# EAGLE schematic GSR (EAGLE 8.4.0)
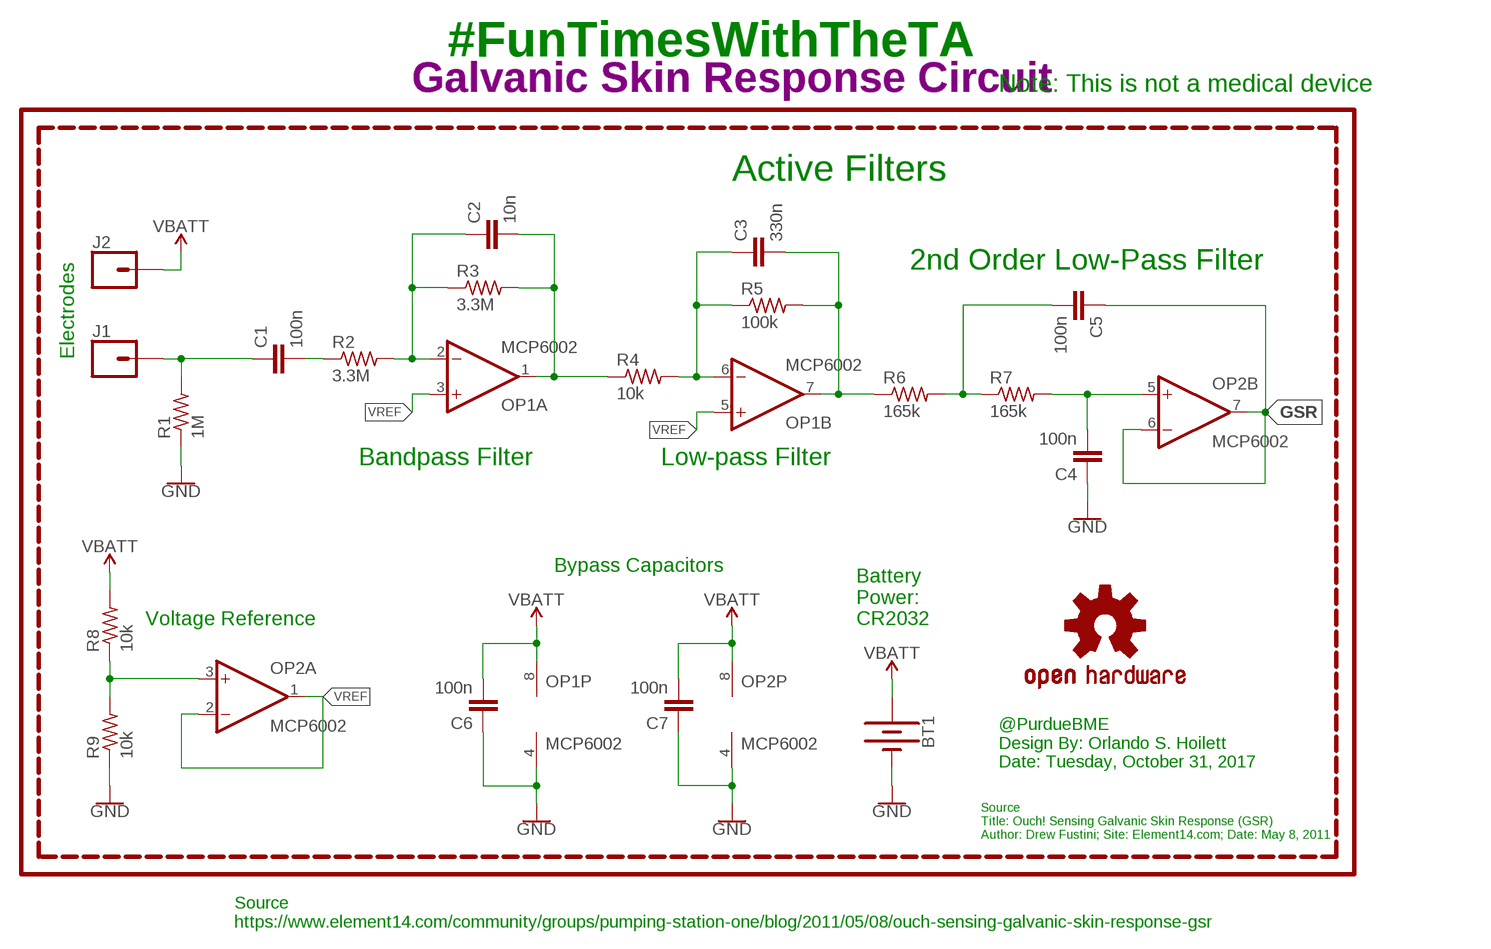
[diagram p0: schematic, sheet 1]

## Parts
BT1  BATTERY-20MM_SMD_4LEGS_OVERPASTE  [BATTCON_20MM_4LEGS_OVERPASTE]
C1  100n  CAPACITOR0402  [C0402]
C2  10n  CAPACITOR0402  [C0402]
C3  330n  CAPACITOR0402  [C0402]
C4  100n  CAPACITOR0402  [C0402]
C5  100n  CAPACITOR0402  [C0402]
C6  100n  CAPACITOR0402  [C0402]
C7  100n  CAPACITOR0402  [C0402]
J1  CONN_01  [1X01]
J2  CONN_01  [1X01]
LOGO1  OSHW-LOGOM  [OSHW-LOGO-M]
OP1  MCP6002  OP-DUALRM  [MSOP08]
OP2  MCP6002  OP-DUALRM  [MSOP08]
R1  1M  RESISTOR0402  [R0402]
R2  3.3M  RESISTOR0402  [R0402]
R3  3.3M  RESISTOR0402  [R0402]
R4  10k  RESISTOR0402  [R0402]
R5  100k  RESISTOR0402  [R0402]
R6  165k  RESISTOR0402  [R0402]
R7  165k  RESISTOR0402  [R0402]
R8  10k  RESISTOR0402  [R0402]
R9  10k  RESISTOR0402  [R0402]

## Nets
GND: BT1.2(-) C4.1 C6.1 C7.1 OP1.4(P:V-) OP2.4(P:V-) R1.1 R9.1
GSR: C5.1 OP2.6(B:-IN) OP2.7(B:OUT)
N$1: C1.2 R2.1
N$2: C2.1 OP1.2(A:-IN) R2.2 R3.1
N$3: C5.2 R6.2 R7.1
N$4: C2.2 OP1.1(A:OUT) R3.2 R4.1
N$5: C4.2 OP2.5(B:+IN) R7.2
N$7: C1.1 J1.1 R1.2
N$8: C3.1 OP1.6(B:-IN) R4.2 R5.1
N$10: C3.2 OP1.7(B:OUT) R5.2 R6.1
N$13: OP2.3(A:+IN) R8.1 R9.2
V_BATT: BT1.1(+) C6.2 C7.2 J2.1 OP1.8(P:V+) OP2.8(P:V+) R8.2 ; supply symbol labelled VBATT
VREF: OP1.3(A:+IN) OP1.5(B:+IN) OP2.1(A:OUT) OP2.2(A:-IN)

## Notes on the sheet
- #FunTimesWithTheTA
- Galvanic Skin Response Circuit | Note: This is not a medical device
- Active Filters
- 2nd Order Low-Pass Filter
- Electrodes
- Bandpass Filter | Low-pass Filter
- Bypass Capacitors
- Voltage Reference
- Battery
  Power:
  CR2032
- @PurdueBME
  Design By: Orlando S. Hoilett
  Date: Tuesday, October 31, 2017
- Source
  Title: Ouch! Sensing Galvanic Skin Response (GSR)
  Author: Drew Fustini; Site: Element14.com; Date: May 8, 2011
- Source
  https://www.element14.com/community/groups/pumping-station-one/blog/2011/05/08/ouch-sensing-galvanic-skin-response-gsr

## Library data of the parts
BT1 = CalvEngIO-Connectors:BATTERY: Battery - Single Cell A variety of battery chemistries, sizes, and footprints. Device List: 20MM_PTH - Coin Cell Battery Holder - 20mm (PTH) <https://www.sparkfun.com/products/783> 6.8MM_PTH - Coin Cell Battery Holder - 6.8MM(SMD) <https://www.digikey.com/product-detail/en/seiko-instruments/MS621FE-FL11E/728-1057-ND/1889208?WT.srch=1&gclid=CNOQ5a6LzdQCFZS2wAodXCkE0g> 12MM_SMD - Coin Cell Battery Holder - 12mm (SMD) <https://www.sparkfun.com/products/10592> 12MM_PTH - Coin Cell Battery Holder - 12mm (PTH) <https://www.sparkfun.com/products/7948> 20MM_SMD - 20mm Coin Cell Battery Holder (SMD) (2 legs) Used on the Big Time Watch Kit <https://www.sparkfun.com/products/11734> 20MM_SMD_4LEGS - Coin Cell Battery Holder - 20mm (SMD) <https://www.sparkfun.com/products/11892> 20MM_SMD_4LEGS_OVERPASTE - Coin Cell Battery Holder - 20mm (SMD) <https://www.sparkfun.com/products/11892> (Over-paste on the legs) 24.5MM_PTH - Coin Cell Battery Holder - 24.5mm (PTH) <https://www.sparkfun.com/products/8863> 9V - 9V Battery Holder - PC Mount Used on the SparkFun SparkPunk Sound Kit <https://www.sparkfun.com/products/11177> and SparkFun SparkPunk Sequencer Kit <https://www.sparkfun.com/products/12707> 18650 - Battery Holder - 18650 (PTH) <https://www.sparkfun.com/products/13113> AA - Battery Holder - 1xAA (PTH) <https://www.sparkfun.com/products/7949> AAA - Battery Holder - 1xAAA (PTH) <https://www.sparkfun.com/products/12718> AA_KIT - Battery Holder - 1xAA (PTH) <https://www.sparkfun.com/products/7949> Special kit package - pads only have exposed copper on one side of the board. AAA_KIT - Battery Holder - 1xAAA (PTH) <https://www.sparkfun.com/products/12718> Special kit package - pads only have exposed copper on one side of the board.; PROD_ID: PRT-11892; SF_SKU: BATT-10373
C1-C7 = CalvEngIO-Passives:CAPACITOR
J1 J2 = CalvEngIO-Connectors:CONN_01: Single connection point. Often used as Generic Header-pin footprint for 0.1 inch spaced/style header connections On any of the 0.1 inch spaced packages, you can populate with these: Break Away Headers - Straight <https://www.sparkfun.com/products/116> (PRT-00116) Break Away Male Headers - Right Angle <https://www.sparkfun.com/products/553> (PRT-00553) Female Headers <https://www.sparkfun.com/products/115> (PRT-00115) Break Away Headers - Machine Pin <https://www.sparkfun.com/products/117> (PRT-00117) Break Away Female Headers - Swiss Machine Pin <https://www.sparkfun.com/products/743> (PRT-00743) This device is also useful as a general connection point to wire up your design to another part of your project. Our various solder wires solder well into these plated through hole pads. Hook-Up Wire - Assortment (Stranded, 22 AWG) <https://www.sparkfun.com/products/11375> (PRT-11375) Hook-Up Wire - Assortment (Solid Core, 22 AWG) <https://www.sparkfun.com/products/11367> (PRT-11367) View the entire wire category on our website here <https://www.sparkfun.com/categories/141> Special notes: SMTSO-256-ET is a "flush mount" nut for a 4-40 screw. We mostly use this on specialty testbeds; it is a nice way to connect hardware to your PCB at an adjustable hieght. Also note, the SNAP packages are for using a snappable style connector. We sell a baggie of snaps and they are also used on two LilyPad designs: Snap Assortment - 30 pack (male and female) <https://www.sparkfun.com/products/11347> (DEV-11347) LilyPad Arduino SimpleSnap <https://www.sparkfun.com/products/10941> (DEV-10941) LilyPad SimpleSnap Protoboard <https://www.sparkfun.com/products/10940> (DEV-10940)
LOGO1 = CalvEngIO-Logos:OSHW-LOGO: Open-Source Hardware (OSHW) Logo This logo indicates the piece of hardware it is found on incorporates a OSHW license and/or adheres to the definition of open source hardware found here: http://freedomdefined.org/OSHW
OP1 OP2 = CalvEngIO-AnalogIC:OP-DUAL: Precision Micropower, Low Noise CMOS, Rail-to-Rail Input/Output Operational Amplifiers Source: http://www.analog.com/static/imported-files/data_sheets/AD8603_8607_8609.pdf; MF: ALTERA CORPORATION; MPN: AD8607ARMZ-REEL; OC_FARNELL: 1464990; OC_NEWARK: 59K6925
R1-R9 = CalvEngIO-Passives:RESISTOR